# Altium schematic sheet Fuse.SchDoc
size A; SheetNumber: 2; SheetTotal: 8
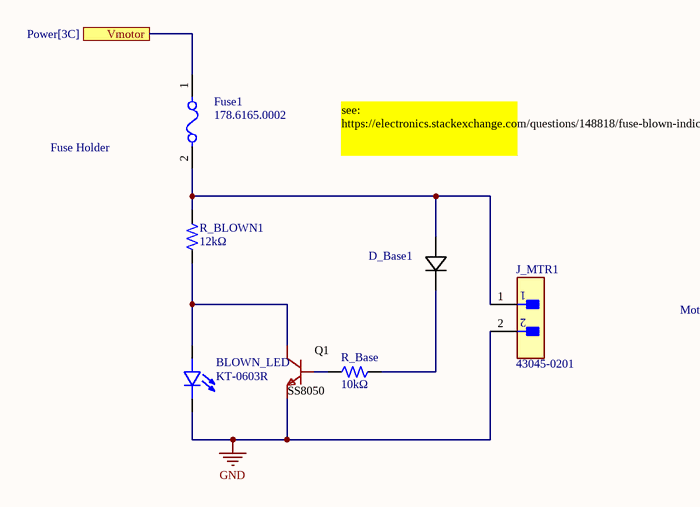
[diagram p0: Fuse.SchDoc]

## Parts
BLOWN_LED  KT-0603R  [LED_KT-0603R]
D_Base1  Diode  [M7_MDD]  (value not drawn)
Fuse1  178.6165.0002  [FP-178_6165-MFG]
J_MTR1  43045-0201  [FP-43045-0201-MFG]
Q1  SS8050  [SOT-23-3_L2.9-W1.3-P1.90-LS2.4-BR]
R_Base  Resistance: 10kΩ  [RES-0603]  (hidden comment: 0603WAF1002T5E)
R_BLOWN1  Resistance: 12kΩ  [RES-0402]  (hidden comment: 0402WGF1202TCE)

## Ports
Vmotor (see Power[3C])

## Nets
GND: BLOWN_LED.C J_MTR1.2 Q1.2(E)
Vmotor: Fuse1.1 ; port Vmotor
NetBLOWN_LED_A: BLOWN_LED.A Q1.3(C) R_BLOWN1.1
NetD_Base1_1: D_Base1.1(CATHODE) R_Base.2
NetD_Base1_2: D_Base1.2(ANODE) Fuse1.2 J_MTR1.1 R_BLOWN1.2
NetQ1_1: Q1.1(B) R_Base.1

## Notes on the sheet
- (near Fuse1) Fuse Holder
- see: https://electronics.stackexchange.com/questions/148818/fuse-blown-indicator-circuits-compilation
- (near J_MTR1) Motor Power Connector

## Library data of the parts
BLOWN_LED = KT-0603R: Red 0603 Light Emitting Diodes; MF: Hubei KENTO Elec; SnapEDA_Link: https://www.snapeda.com/parts/KT-0603R/Hubei+KENTO+Elec/view-part/?ref=snap; Package: Package; Value: *; MP: KT-0603R; Check_prices: https://www.snapeda.com/parts/KT-0603R/Hubei+KENTO+Elec/view-part/?ref=eda
D_Base1 = M7: 1A Independent Type 1kV 1.1V@1A SMA(DO-214AC) Diodes - General Purpose ROHS; Mfr_Name: Microdiode Electronics
Fuse1 = CMP-08604-000022-1: FUSE HOLDER BLADE 80V PCB; Manufacturer: Littelfuse; Standoff Height: 1mm; Number Of Fuses: 1; Conn Orientation: Vertical; Device Class L1: Circuit Protection; Height: 17.5mm; Mouser Description: Fuse Holder FLR (ATO) PCB 4-pin Holder; Device Class L3: unset; Lead Free: Yes; Digikey Description: FUSE HOLDER BLADE 80V PCB; Voltage Rating Ac: 80V; ComponentLink2Description: Datasheet; Manufacturer Part Number: 178.6165.0002; Voltage Rating Dc: 80V; Automotive: No; Octopart: https://octopart.com/178.6165.0002-littelfuse-13138759; Device Class L2: Fuse Holders; Package: 178.6165; RoHS: TRUE; ComponentLink2URL: https://www.littelfuse.com/~/media/commercial-vehicle/datasheets/automotive-fuse-holders/ato/littelfuse-fuse-holder-ato-flr-pcb-datasheet.pdf; Category: Fuse
J_MTR1 = CMP-04776-000998-1: CONN HEADER R/A 2POS; Number of Circuits: 2; Glow Wire Compliant: Compliant; Pitch: 3mm; Max Voltage Rating (DC): 250.25kV; Current Rating: 5A; Contact Resistance: 10mR; Gender: Male; Voltage Rating: 250V; Number of Positions: 2; Halogen Free: Low Halogen; Series: 43045; Mount: Through Hole; Packaging: Tray; Row Spacing: 3mm; Contact Material: Brass; Radiation Hardening: No; Number of Contacts: 2; Orientation: Right Angle; Max Operating Temperature: 105°C; Housing Material: Thermoplastic; Contact Plating: Gold; Case/Package: 0201; Number of Rows: 2; Min Operating Temperature: -40°C; Termination: Solder; Package Quantity: 3168
Q1 = SS8050(RANGE:200-350)_C2150: BJT NPN; Manufacturer: CJ(江苏长电/长晶); Symbol: SS8050_C2150; Add into BOM: yes; DC Current Gain (hFE@Ic,Vce): 200@800mA,1V; Transition Frequency (fT): 100MHz; Collector Cut-Off Current (Icbo): 100nA; Collector-Emitter Saturation Voltage (VCE(sat)@Ic,Ib): 500mV@800mA,80mA; Device: SS8050(RANGE:200-350)_C2150; LCSC Part Name: NPN 电流:1.5A 耐压:25V hfe=200~350; Supplier Part: C2150; Manufacturer Part: SS8050(RANGE:200-350); Supplier Footprint: SOT-23; JLCPCB Part Class: Basic Part; Datasheet: https://atta.szlcsc.com/upload/public/pdf/source/20230322/AEE86F4B043774EFF80CAEA14A37D9E9.pdf; Supplier: LCSC; Convert to PCB: yes; Operating Temperature: -55℃~+150℃
R_Base = 0603WAF1002T5E: Resistor, 10kΩ, ±1%, 100mW, 75V, ±100ppm/℃, -55℃~+155℃, SMD 0603; Manufacturer: Uniroyal; Supplier 1: LCSC; Manufacturer Part Number: 0603WAF1002T5E; Supplier Part Number 1: C25804; JLCPCB Part Number: C25804; Power Rating: 100mW; Category: Resistors; Package Size: 0603; JLCPCB Basic Part: Yes; Tolerance: ±1%; Voltage Rating: 75V; Temperature Coefficient: ±100ppm/℃; Temperature Rating: -55℃~+155℃; ComponentLink1Description: Datasheet; ComponentLink1URL: https://wmsc.lcsc.com/wmsc/upload/file/pdf/v2/lcsc/2206010045_UNI-ROYAL-Uniroyal-Elec-0603WAF1002T5E_C25804.pdf; ComponentLink2Description: JLCPCB Part URL; ComponentLink2URL: https://jlcpcb.com/partdetail/C25804
R_BLOWN1 = 0402WGF1202TCE: Resistor, 12kΩ, ±1%, 62.5mW, 50V, ±100ppm/℃, -55℃~+155℃, SMD 0402; Manufacturer: Uniroyal; Supplier 1: LCSC; Manufacturer Part Number: 0402WGF1202TCE; Supplier Part Number 1: C25752; JLCPCB Part Number: C25752; Power Rating: 62.5mW; Category: Resistors; Package Size: 0402; JLCPCB Basic Part: Yes; Tolerance: ±1%; Voltage Rating: 50V; Temperature Coefficient: ±100ppm/℃; Temperature Rating: -55℃~+155℃; ComponentLink1Description: Datasheet; ComponentLink1URL: https://wmsc.lcsc.com/wmsc/upload/file/pdf/v2/lcsc/2206010100_UNI-ROYAL-Uniroyal-Elec-0402WGF1202TCE_C25752.pdf; ComponentLink2Description: JLCPCB Part URL; ComponentLink2URL: https://jlcpcb.com/partdetail/C25752